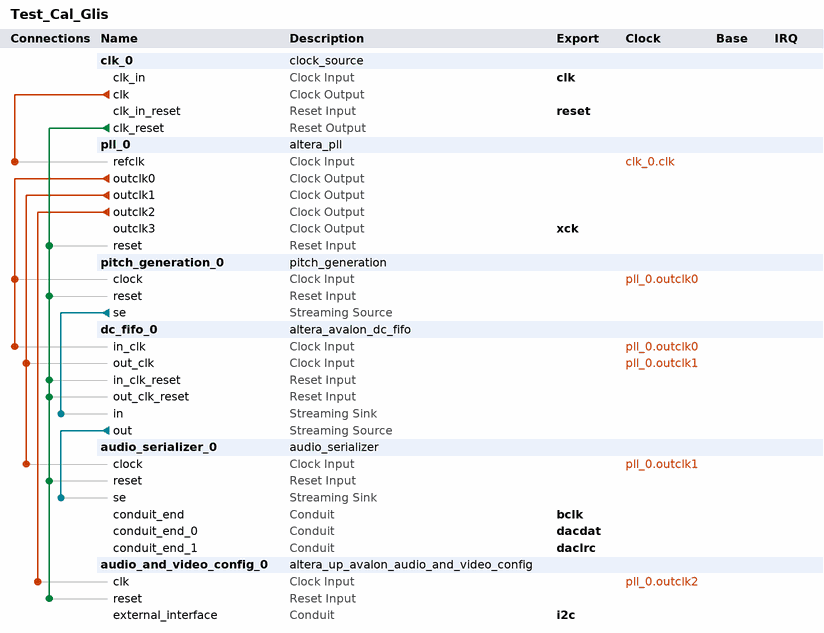
[diagram p0: system contents]
# Platform Designer (Qsys) system Test_Cal_Glis, Cyclone V 5CSEMA5F31C6
# Parameters at their usual value, and those the tool derives, are not listed.
package require -exact qsys 17.1
create_system Test_Cal_Glis
set_project_property DEVICE_FAMILY {Cyclone V}
set_project_property DEVICE 5CSEMA5F31C6

add_instance clk_0 clock_source 17.1
set_instance_parameter_value clk_0 clockFrequency 50000000

add_instance pll_0 altera_pll 17.1
set_instance_parameter_value pll_0 gui_device_speed_grade 1
set_instance_parameter_value pll_0 gui_number_of_clocks 4
set_instance_parameter_value pll_0 gui_operation_mode direct
set_instance_parameter_value pll_0 gui_output_clock_frequency0 54.0
set_instance_parameter_value pll_0 gui_output_clock_frequency1 24.0
set_instance_parameter_value pll_0 gui_output_clock_frequency2 12.0
set_instance_parameter_value pll_0 gui_output_clock_frequency3 12.0
set_instance_parameter_value pll_0 gui_pll_mode {Integer-N PLL}
set_instance_parameter_value pll_0 gui_reference_clock_frequency 50.0
set_instance_parameter_value pll_0 gui_use_locked false

add_instance pitch_generation_0 pitch_generation 1.0

add_instance dc_fifo_0 altera_avalon_dc_fifo 17.1
set_instance_parameter_value dc_fifo_0 BITS_PER_SYMBOL 24
set_instance_parameter_value dc_fifo_0 FIFO_DEPTH 2
set_instance_parameter_value dc_fifo_0 USE_PACKETS 0

add_instance audio_serializer_0 audio_serializer 1.0

add_instance audio_and_video_config_0 altera_up_avalon_audio_and_video_config 17.1
set_instance_parameter_value audio_and_video_config_0 audio_in {Microphone to ADC}
set_instance_parameter_value audio_and_video_config_0 bit_length 24
set_instance_parameter_value audio_and_video_config_0 board DE1-SoC
set_instance_parameter_value audio_and_video_config_0 line_in_bypass false
set_instance_parameter_value audio_and_video_config_0 sampling_rate {48 kHz}

# connections
add_connection clk_0.clk pll_0.refclk clock
add_connection pll_0.outclk0 dc_fifo_0.in_clk clock
add_connection pll_0.outclk0 pitch_generation_0.clock clock
add_connection pll_0.outclk1 audio_serializer_0.clock clock
add_connection pll_0.outclk1 dc_fifo_0.out_clk clock
add_connection pll_0.outclk2 audio_and_video_config_0.clk clock
add_connection clk_0.clk_reset audio_and_video_config_0.reset reset
add_connection clk_0.clk_reset audio_serializer_0.reset reset
add_connection clk_0.clk_reset dc_fifo_0.in_clk_reset reset
add_connection clk_0.clk_reset dc_fifo_0.out_clk_reset reset
add_connection clk_0.clk_reset pitch_generation_0.reset reset
add_connection clk_0.clk_reset pll_0.reset reset
add_connection dc_fifo_0.out audio_serializer_0.se avalon_streaming
add_connection pitch_generation_0.se dc_fifo_0.in avalon_streaming

# exported interfaces
add_interface bclk conduit end
set_interface_property bclk EXPORT_OF audio_serializer_0.conduit_end
add_interface clk clock sink
set_interface_property clk EXPORT_OF clk_0.clk_in
add_interface dacdat conduit end
set_interface_property dacdat EXPORT_OF audio_serializer_0.conduit_end_0
add_interface daclrc conduit end
set_interface_property daclrc EXPORT_OF audio_serializer_0.conduit_end_1
add_interface i2c conduit end
set_interface_property i2c EXPORT_OF audio_and_video_config_0.external_interface
add_interface reset reset sink
set_interface_property reset EXPORT_OF clk_0.clk_in_reset
add_interface xck clock source
set_interface_property xck EXPORT_OF pll_0.outclk3

set_interconnect_requirement {$system} qsys_mm.clockCrossingAdapter HANDSHAKE
set_interconnect_requirement {$system} qsys_mm.enableEccProtection FALSE
set_interconnect_requirement {$system} qsys_mm.insertDefaultSlave FALSE
set_interconnect_requirement {$system} qsys_mm.maxAdditionalLatency 1

save_system Test_Cal_Glis.qsys
